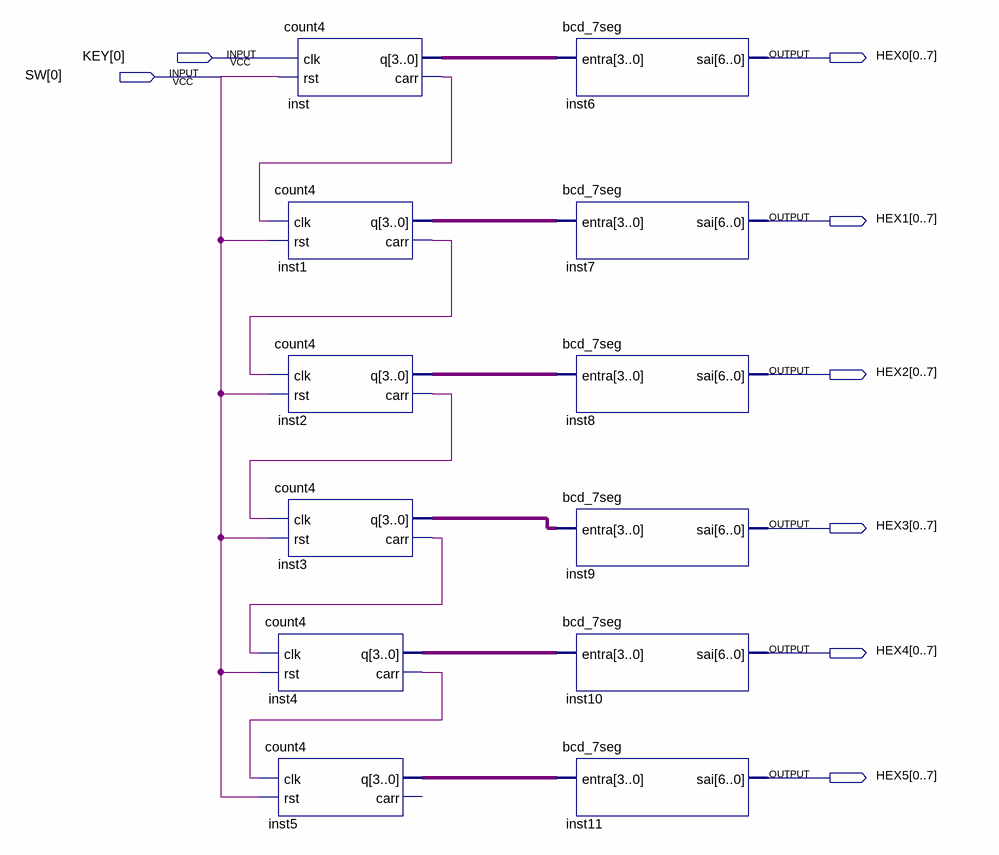
[diagram p0: schematic sheet]
// Quartus schematic main.bdf as structural Verilog: 12 symbols, 8 pins
module main (
  input  [0:0] KEY,
  input  [0:0] SW,
  output [0:7] HEX0,
  output [0:7] HEX1,
  output [0:7] HEX2,
  output [0:7] HEX3,
  output [0:7] HEX4,
  output [0:7] HEX5
);

  wire inst1_carr, inst2_carr, inst3_carr, inst4_carr, inst_carr;
  wire [3:0] inst1_q, inst2_q, inst3_q, inst4_q, inst5_q, inst_q;

  count4 inst (.clk(KEY[0]), .rst(SW[0]), .q(inst_q), .carr(inst_carr));
  count4 inst1 (.clk(inst_carr), .rst(SW[0]), .q(inst1_q), .carr(inst1_carr));
  count4 inst2 (.clk(inst1_carr), .rst(SW[0]), .q(inst2_q), .carr(inst2_carr));
  count4 inst3 (.clk(inst2_carr), .rst(SW[0]), .q(inst3_q), .carr(inst3_carr));
  count4 inst4 (.clk(inst3_carr), .rst(SW[0]), .q(inst4_q), .carr(inst4_carr));
  count4 inst5 (.clk(inst4_carr), .rst(SW[0]), .q(inst5_q));  // open: carr
  bcd_7seg inst6 (.entra(inst_q), .sai(HEX0));
  bcd_7seg inst7 (.entra(inst1_q), .sai(HEX1));
  bcd_7seg inst8 (.entra(inst2_q), .sai(HEX2));
  bcd_7seg inst9 (.entra(inst3_q), .sai(HEX3));
  bcd_7seg inst10 (.entra(inst4_q), .sai(HEX4));
  bcd_7seg inst11 (.entra(inst5_q), .sai(HEX5));
endmodule
